# EAGLE design nodemcu1 (EAGLE 9.6.2)
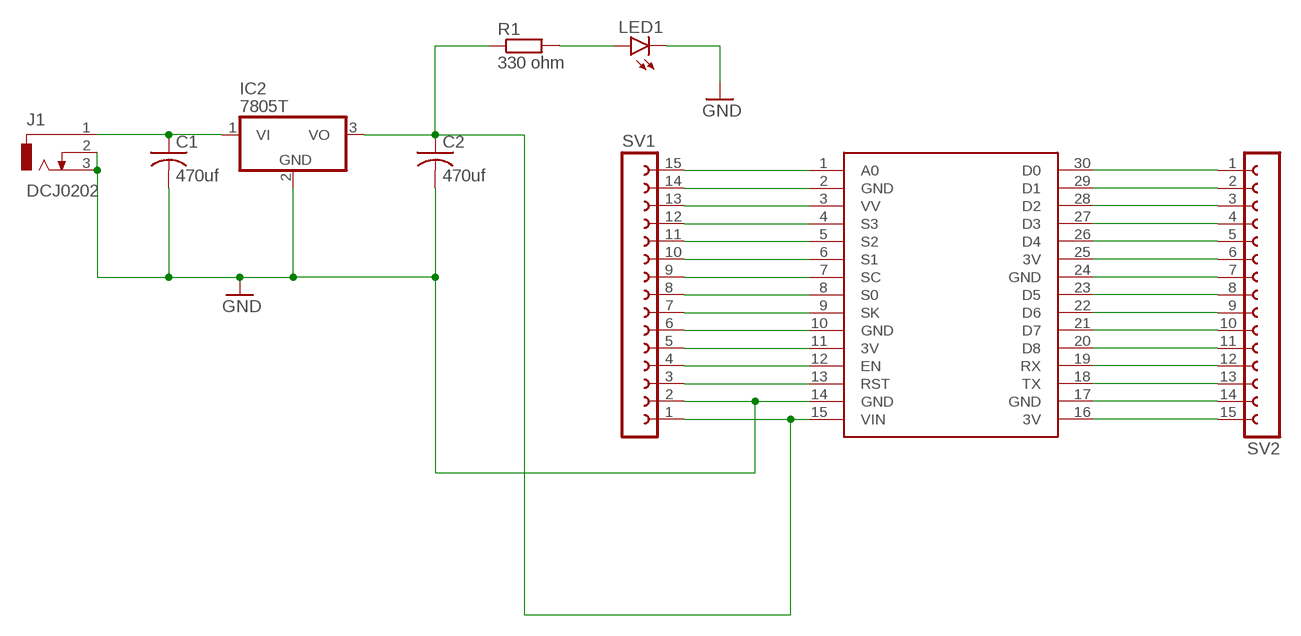
[diagram p0: schematic, sheet 1]

## Parts
C1  470uf  C-US025-024X044  [C025-024X044]
C2  470uf  C-US025-024X044  [C025-024X044]
IC2  7805T  [TO220H]
J1  DCJ0202  [DCJ0202]
LED1  LEDLD260  [LD260]
R1  330 ohm  R-EU_0204/5  [0204/5]
SV1  FE15-1  [FE15]
SV2  FE15-1  [FE15]
U$1  NODEMCU  [NODEMCU]

## Nets
GND: C1.2 C2.2 IC2.2(GND) J1.2 J1.3 LED1.K(C) SV1.2 U$1.14(GND)
N$3: SV1.3 U$1.13(RST)
N$4: SV1.4 U$1.12(EN)
N$5: SV1.5 U$1.11(3V)
N$6: SV1.6 U$1.10(GND)
N$7: SV1.7 U$1.9(SK)
N$8: SV1.8 U$1.8(S0)
N$9: SV1.9 U$1.7(SC)
N$10: SV1.10 U$1.6(S1)
N$11: SV1.11 U$1.5(S2)
N$12: SV1.12 U$1.4(S3)
N$13: SV1.13 U$1.3(VV)
N$14: SV1.14 U$1.2(GND)
N$15: SV1.15 U$1.1(A0)
N$16: SV2.1 U$1.30(D0)
N$17: SV2.2 U$1.29(D1)
N$18: SV2.3 U$1.28(D2)
N$19: SV2.4 U$1.27(D3)
N$20: SV2.5 U$1.26(D4)
N$21: SV2.6 U$1.25(3V)
N$22: SV2.7 U$1.24(GND)
N$23: SV2.8 U$1.23(D5)
N$24: SV2.9 U$1.22(D6)
N$25: SV2.10 U$1.21(D7)
N$26: SV2.11 U$1.20(D8)
N$27: SV2.12 U$1.19(RX)
N$28: SV2.13 U$1.18(TX)
N$29: SV2.14 U$1.17(GND)
N$30: SV2.15 U$1.16(3V)
N$31: C2.1 IC2.3(VO) R1.1 SV1.1 U$1.15(VIN)
N$32: C1.1 IC2.1(VI) J1.1
N$33: LED1.A R1.2

## Library data of the parts
C1 C2 = rcl:C-US: CAPACITOR, American symbol; SPICEPREFIX: C
IC2 = linear:78*: Positive VOLTAGE REGULATOR Source: http://cache.national.com/ds/LM/LM78L05.pdf http://www.fairchildsemi.com/ds/LM/LM7805.pdf
J1 = con-jack:DCJ0202: DC POWER JACK Source: DCJ0202.pdf; OC_FARNELL: unknown; OC_NEWARK: unknown
LED1 = led:LED: LED OSRAM: - CHIPLED LG R971, LG N971, LY N971, LG Q971, LY Q971, LO R971, LY R971 LH N974, LH R974 LS Q976, LO Q976, LY Q976 LO Q996 - Hyper CHIPLED LW Q18S LB Q993, LB Q99A, LB R99A - SideLED LS A670, LO A670, LY A670, LG A670, LP A670 LB A673, LV A673, LT A673, LW A673 LH A674 LY A675 LS A676, LA A676, LO A676, LY A676, LW A676 LS A679, LY A679, LG A679 - Hyper Micro SIDELED® LS Y876, LA Y876, LO Y876, LY Y876 LT Y87S - SmartLED LW L88C, LW L88S LB L89C, LB L89S, LG L890 LS L89K, LO L89K, LY L89K LS L896, LA L896, LO L896, LY L896 - TOPLED LS T670, LO T670, LY T670, LG T670, LP T670 LSG T670, LSP T670, LSY T670, LOP T670, LYG T670 LG T671, LOG T671, LSG T671 LB T673, LV T673, LT T673, LW T673 LH T674 LS T676, LA T676, LO T676, LY T676, LB T676, LH T676, LSB T676, LW T676 LB T67C, LV T67C, LT T67C, LS T67K, LO T67K, LY T67K, LW E67C LS E67B, LA E67B, LO E67B, LY E67B, LB E67C, LV E67C, LT E67C LW T67C LS T679, LY T679, LG T679 LS T770, LO T770, LY T770, LG T770, LP T770 LB T773, LV T773, LT T773, LW T773 LH T774 LS E675, LA E675, LY E675, LS T675 LS T776, LA T776, LO T776, LY T776, LB T776 LHGB T686 LT T68C, LB T68C - Hyper Mini TOPLED® LB M676 - Mini TOPLED Santana® LG M470 LS M47K, LO M47K, LY M47K Source: http://www.osram.convergy.de LUXEON: - LUMILED® LXK2-PW12-R00, LXK2-PW12-S00, LXK2-PW14-U00, LXK2-PW14-V00 LXK2-PM12-R00, LXK2-PM12-S00, LXK2-PM14-U00 LXK2-PE12-Q00, LXK2-PE12-R00, LXK2-PE12-S00, LXK2-PE14-T00, LXK2-PE14-U00 LXK2-PB12-K00, LXK2-PB12-L00, LXK2-PB12-M00, LXK2-PB14-N00, LXK2-PB14-P00, LXK2-PB14-Q00 LXK2-PR12-L00, LXK2-PR12-M00, LXK2-PR14-Q00, LXK2-PR14-R00 LXK2-PD12-Q00, LXK2-PD12-R00, LXK2-PD12-S00 LXK2-PH12-R00, LXK2-PH12-S00 LXK2-PL12-P00, LXK2-PL12-Q00, LXK2-PL12-R00 Source: www.luxeon.com KINGBRIGHT: KA-3528ASYC Source: www.kingbright.com
R1 = rcl:R-EU_: RESISTOR, European symbol; SPICEPREFIX: R
SV1 SV2 = con-lsta:FE15-1: FEMALE HEADER; OC_FARNELL: unknown; OC_NEWARK: unknown
U$1 = nodemcu:NODEMCU

## Board
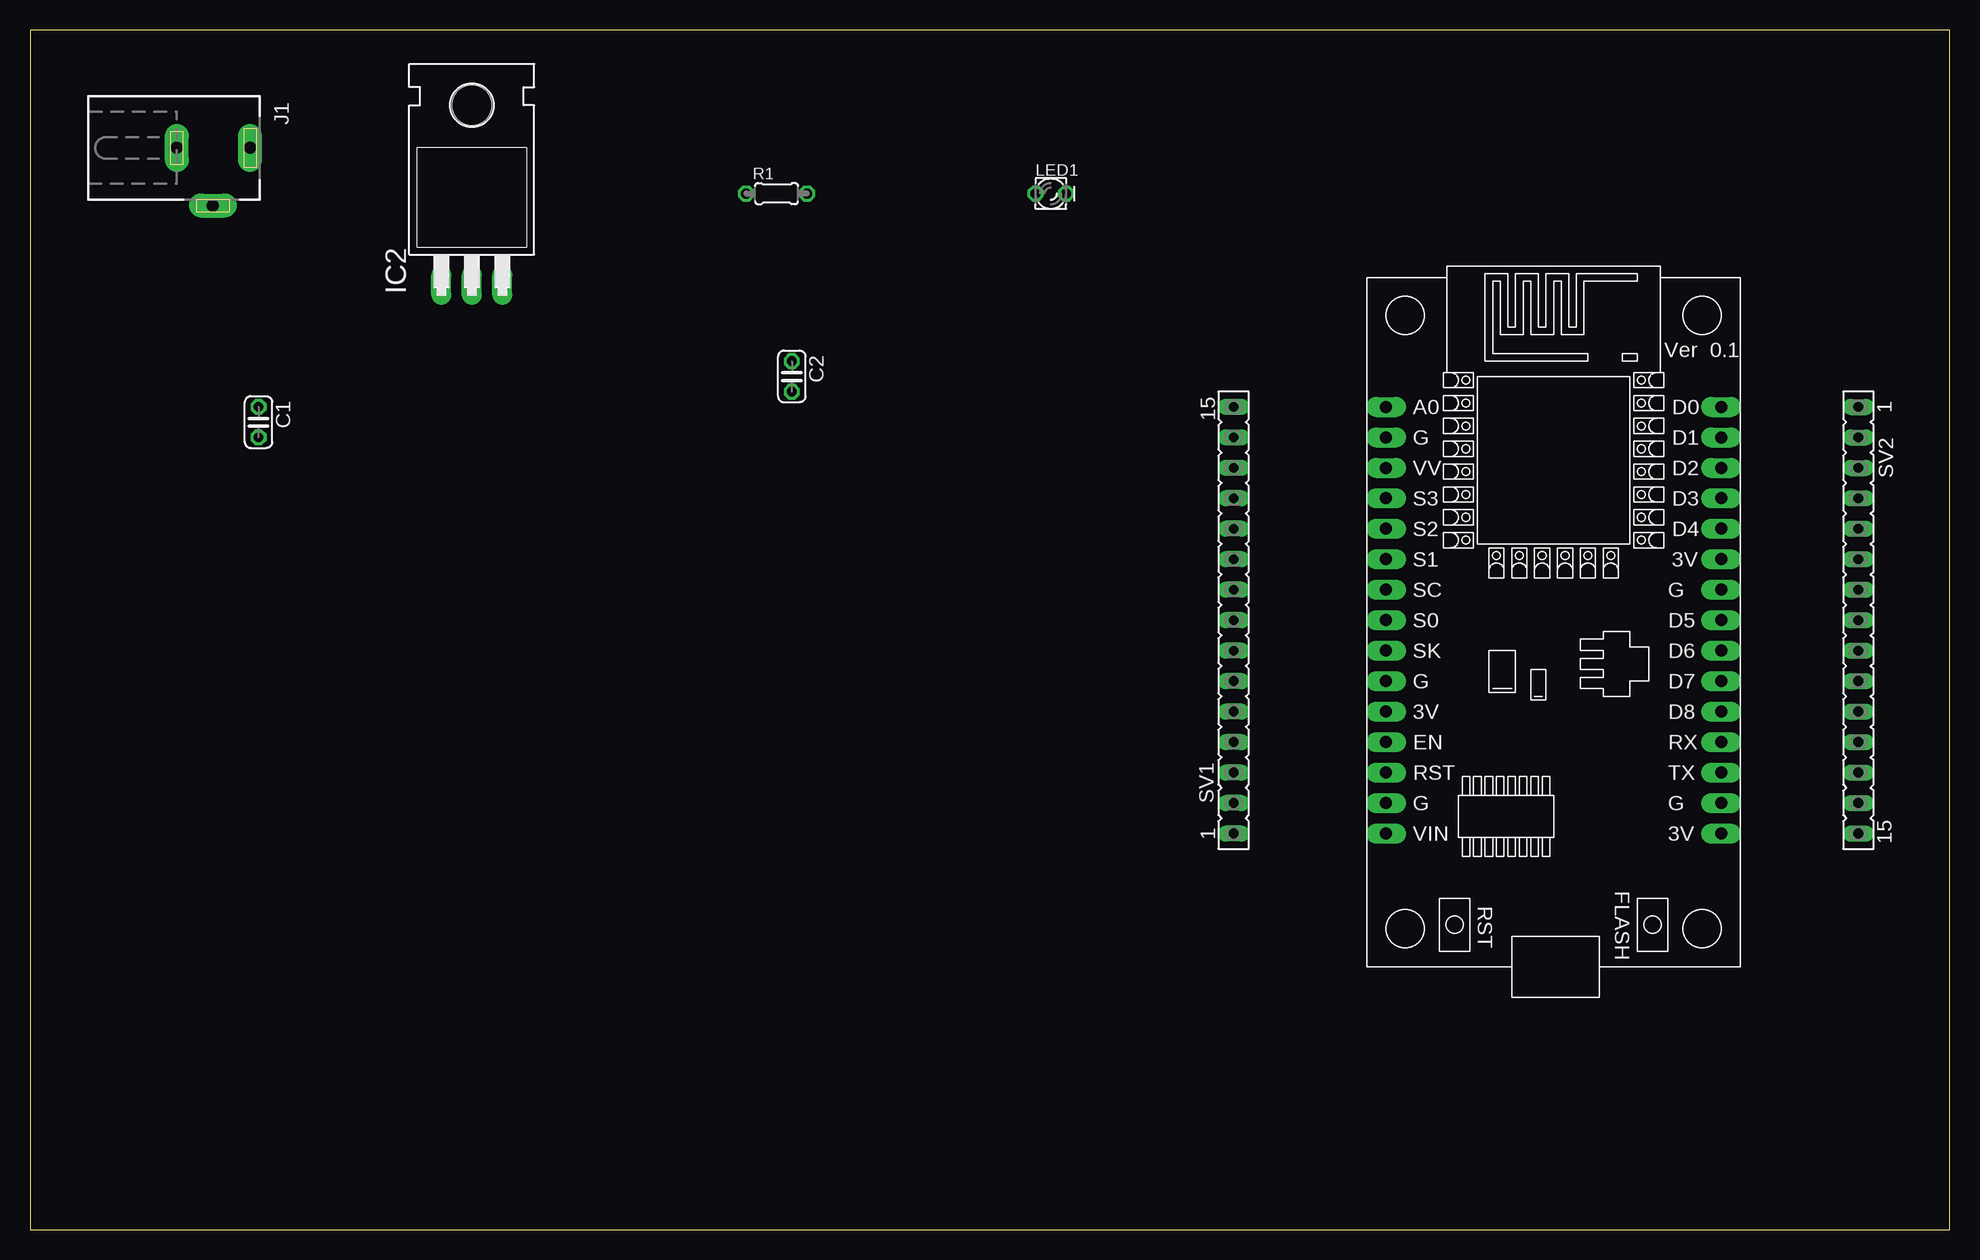
[diagram p1: board, top side]
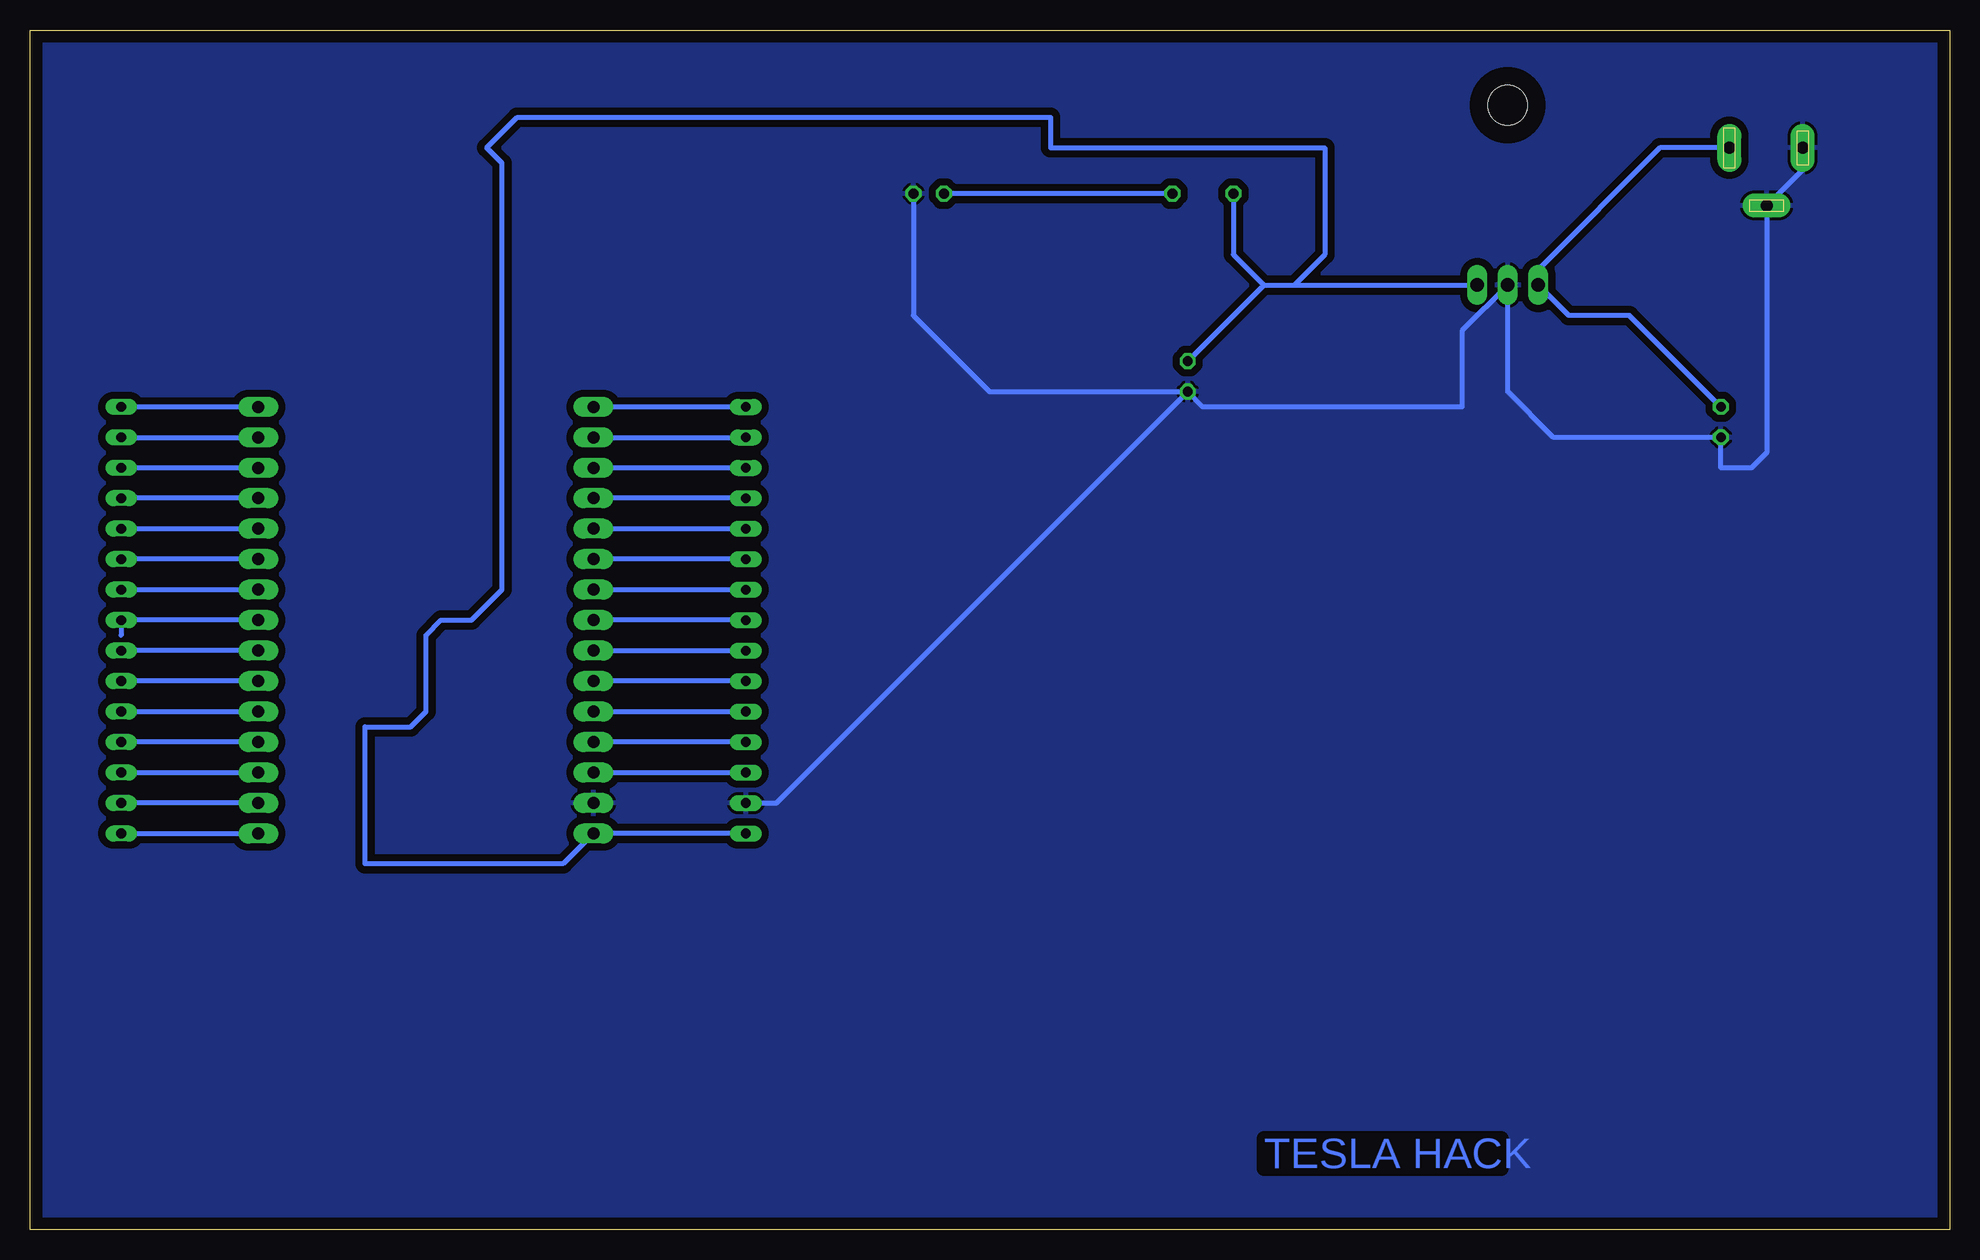
[diagram p2: board, bottom side, seen from below]

Size 160 x 100 mm. Coordinates in mm from the lower left corner, seen from the top.
Outline: 0,0 160,0 160,100 0,100 0,0
Copper layers (1*16): Top 0.035mm / dielectric 1.5mm / Bottom 0.035mm
Design rules "default": minimum track width 6mil, minimum drill 0.35mm, track to track 6mil, track to pad 6mil, pad to pad 6mil, via to via 6mil, smd to smd 6mil, copper to edge 40mil, drill to drill 6mil, minimum pad ring 10mil, minimum via ring 8mil, stop-mask expansion 4mil, vias tented up to drill 0mil, thermal gap 10mil

### Footprints (pad centres in the part's own frame; a part is rotated, then mirrored left to right if it is on the bottom)
C025-024X044 = drill 0.813 octagon: 1 -1.27,0; 2 1.27,0
TO220H = drill 1.118 long: 1 -2.54,-10.16; 2 0,-10.16; 3 2.54,-10.16 | hole 3.302: 0,4.826
DCJ0202 = drill 1 pad 2 long: 1 0,3.1; 2 4.8,0; 3 0,-3
LD260 = drill 0.813 octagon: A -1.27,0; K 1.27,0
0204/5 = drill 0.813 octagon: 1 -2.54,0; 2 2.54,0
FE15 = drill 0.813 long: 1 -17.78,0; 2 -15.24,0; 3 -12.7,0; 4 -10.16,0; 5 -7.62,0; 6 -5.08,0; 7 -2.54,0; 8 0,0; 9 2.54,0; 10 5.08,0; 11 7.62,0; 12 10.16,0; 13 12.7,0; 14 15.24,0; 15 17.78,0
NODEMCU = drill 1 pad 1.676 long: 1 -13.97,17.78; 2 -13.97,15.24; 3 -13.97,12.7; 4 -13.97,10.16; 5 -13.97,7.62; 6 -13.97,5.08; 7 -13.97,2.54; 8 -13.97,0; 9 -13.97,-2.54; 10 -13.97,-5.08; 11 -13.97,-7.62; 12 -13.97,-10.16; 13 -13.97,-12.7; 14 -13.97,-15.24; 15 -13.97,-17.78; 16 13.97,-17.78; 17 13.97,-15.24; 18 13.97,-12.7; 19 13.97,-10.16; 20 13.97,-7.62; 21 13.97,-5.08; 22 13.97,-2.54; 23 13.97,0; 24 13.97,2.54; 25 13.97,5.08; 26 13.97,7.62; 27 13.97,10.16; 28 13.97,12.7; 29 13.97,15.24; 30 13.97,17.78

### Placement (x,y rotation side)
C1  19.05,67.31 270 top
C2  63.5,71.12 270 top
IC2  36.83,88.9 0 top
J1  15.24,90.17 270 top
LED1  85.09,86.36 0 top
R1  62.23,86.36 0 top
SV1  100.33,50.8 90 top
SV2  152.4,50.8 270 top
U$1  127,50.8 0 top

### Tracks (layer width: path | path; a pad name or v marks a point on that pad's centre or on a via)
GND
  Bottom 0.406: J1.3 12.24,88.37 J1.2 15.24,64.77 16.51,63.5 19.05,63.5 C1.2 33.02,66.04 36.83,69.85 IC2.2 40.64,74.93 40.64,68.58 62.23,68.58 C2.2 | LED1.K 86.36,76.2 80.01,69.85 C2.2 | SV1.2 97.79,35.56 C2.2
  pour Bottom (isolate 0.61): 0,100.33 160.02,100.33 160.02,0 0,0 0,99.06 0,99.06
N$3
  Bottom 0.406: U$1.13 SV1.3
N$4
  Bottom 0.406: SV1.4 U$1.12
N$5
  Bottom 0.406: U$1.11 SV1.5
N$6
  Bottom 0.406: SV1.6 U$1.10
N$7
  Bottom 0.406: U$1.9 SV1.7
N$8
  Bottom 0.406: SV1.8 U$1.8
N$9
  Bottom 0.406: U$1.7 SV1.9
N$10
  Bottom 0.406: SV1.10 U$1.6
N$11
  Bottom 0.406: U$1.5 SV1.11
N$12
  Bottom 0.406: SV1.12 U$1.4
N$13
  Bottom 0.406: SV1.13 U$1.3
N$14
  Bottom 0.406: U$1.2 SV1.14
N$15
  Bottom 0.406: SV1.15 U$1.1
N$16
  Bottom 0.406: U$1.30 SV2.1
N$17
  Bottom 0.406: SV2.2 U$1.29
N$18
  Bottom 0.406: U$1.28 SV2.3
N$19
  Bottom 0.406: U$1.27 SV2.4
N$20
  Bottom 0.406: SV2.5 U$1.26
N$21
  Bottom 0.406: U$1.25 SV2.6
N$22
  Bottom 0.406: SV2.7 U$1.24
N$23
  Bottom 0.406: U$1.23 SV2.8 152.4,49.53
N$24
  Bottom 0.406: U$1.22 SV2.9
N$25
  Bottom 0.406: U$1.21 SV2.10
N$26
  Bottom 0.406: SV2.11 U$1.20
N$27
  Bottom 0.406: U$1.19 SV2.12
N$28
  Bottom 0.406: SV2.13 U$1.18
N$29
  Bottom 0.406: U$1.17 SV2.14
N$30
  Bottom 0.406: SV2.15 U$1.16
N$31
  Bottom 0.406: C2.1 57.15,78.74 | 57.15,78.74 54.61,78.74 | 54.61,78.74 IC2.3 | R1.1 59.69,81.28 57.15,78.74 | U$1.15 113.67,32.38 | 113.67,32.38 115.57,30.48 132.08,30.48 132.08,41.91 128.27,41.91 127,43.18 127,49.53 125.73,50.8 123.19,50.8 120.65,53.34 120.65,88.9 121.92,90.17 119.38,92.71 74.93,92.71 74.93,90.17 52.07,90.17 52.07,81.28 54.61,78.74 | SV1.1 113.67,33.02 113.67,32.38
N$32
  Bottom 0.406: J1.1 24.13,90.17 34.29,80.01 IC2.1 31.75,76.2 26.67,76.2 C1.1
N$33
  Bottom 0.406: R1.2 LED1.A

### Text on the board
Bottom: TESLA HACK